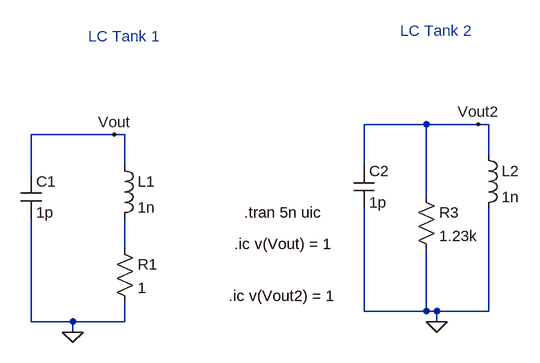
[diagram p0: schematic LC_circuit_3_FIGURE7.asc]
LC_circuit_3_FIGURE7.asc, the LTspice schematic file:
Version 4
SHEET 1 976 680
WIRE 736 48 640 48
WIRE 816 48 736 48
WIRE 832 48 816 48
WIRE 256 64 128 64
WIRE 272 64 256 64
WIRE 832 96 832 48
WIRE 272 112 272 64
WIRE 640 112 640 48
WIRE 128 128 128 64
WIRE 736 160 736 48
WIRE 272 240 272 192
WIRE 640 336 640 176
WIRE 736 336 736 240
WIRE 736 336 640 336
WIRE 752 336 736 336
WIRE 832 336 832 176
WIRE 832 336 752 336
WIRE 128 352 128 192
WIRE 192 352 128 352
WIRE 272 352 272 320
WIRE 272 352 192 352
WIRE 752 352 752 336
WIRE 192 368 192 352
FLAG 192 368 0
FLAG 256 64 Vout
FLAG 752 352 0
FLAG 816 48 Vout2
SYMBOL ind 256 96 R0
SYMATTR InstName L1
SYMATTR Value 1n
SYMATTR SpiceLine Rser=0
SYMBOL cap 112 128 R0
SYMATTR InstName C1
SYMATTR Value 1p
SYMBOL res 256 224 R0
SYMATTR InstName R1
SYMATTR Value 1
SYMBOL ind 816 80 R0
SYMATTR InstName L2
SYMATTR Value 1n
SYMATTR SpiceLine Rser=0
SYMBOL cap 624 112 R0
SYMATTR InstName C2
SYMATTR Value 1p
SYMBOL res 720 144 R0
SYMATTR InstName R3
SYMATTR Value 1.23k
TEXT 456 184 Left 2 !.tran 5n uic
TEXT 432 312 Left 2 !.ic v(Vout2) = 1
TEXT 440 232 Left 2 !.ic v(Vout) = 1
TEXT 216 -88 Left 2 ;LC Tank 1
TEXT 696 -96 Left 2 ;LC Tank 2

The netlist it stands for:
* LC_circuit_3_FIGURE7.asc
L1 Vout N001 1n Rser=0
C1 Vout 0 1p
R1 N001 0 1
L2 Vout2 0 1n Rser=0
C2 Vout2 0 1p
R3 Vout2 0 1.23k
.tran 5n uic
.ic v(Vout2) = 1
.ic v(Vout) = 1
* LC Tank 1
* LC Tank 2
.backanno
.end